# EAGLE schematic main (EAGLE 6.4)
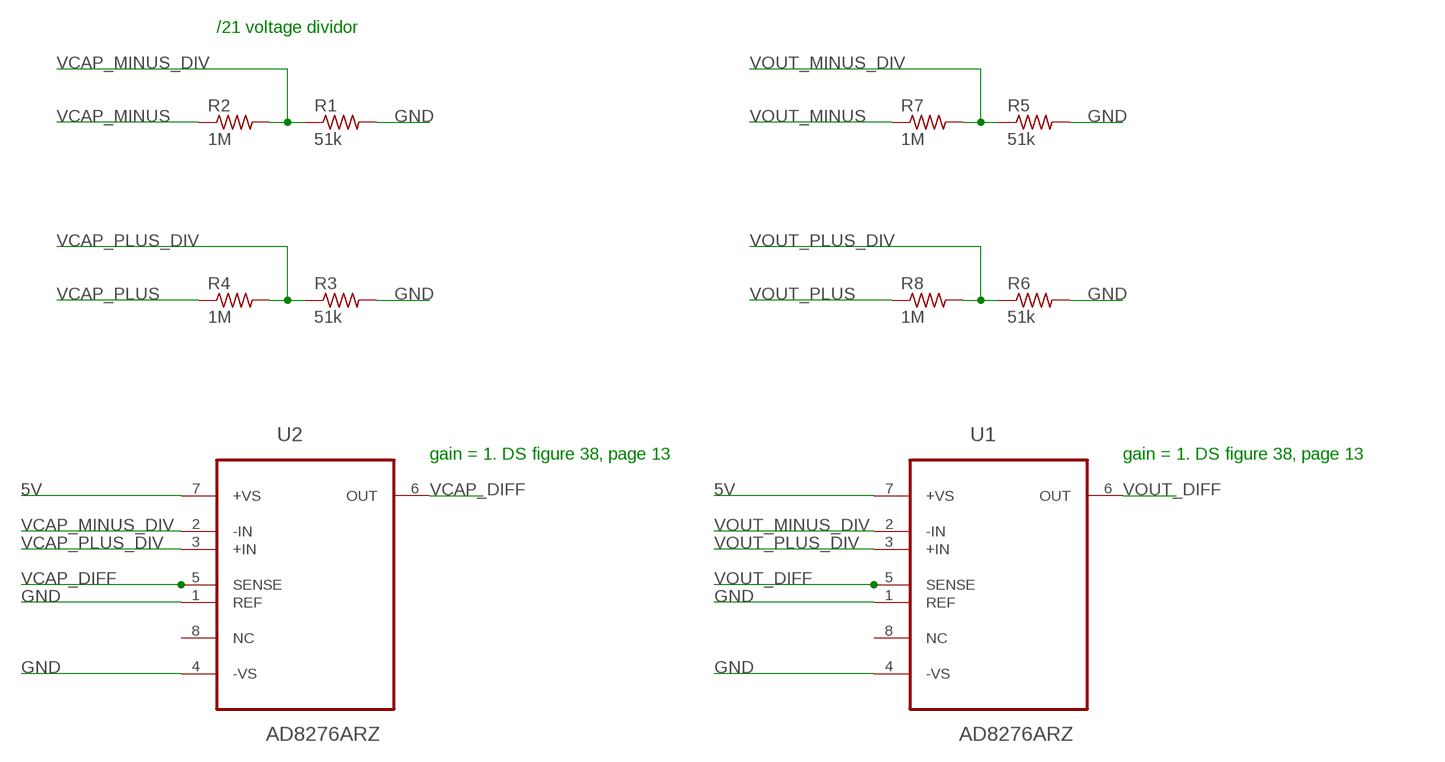
[diagram p0: schematic, sheet 1]

## Parts
R1  51k  R-US_R1206  [R1206]
R2  1M  R-US_R1206  [R1206]
R3  51k  R-US_R1206  [R1206]
R4  1M  R-US_R1206  [R1206]
R5  51k  R-US_R1206  [R1206]
R6  51k  R-US_R1206  [R1206]
R7  1M  R-US_R1206  [R1206]
R8  1M  R-US_R1206  [R1206]
U1  AD8276ARZ  [SOIC127P600X175-8N]
U2  AD8276ARZ  [SOIC127P600X175-8N]

## Nets
5V: U1.7(+VS) U2.7(+VS)
GND: R1.2 R3.2 R5.2 R6.2 U1.1(REF) U1.4(-VS) U2.1(REF) U2.4(-VS)
VCAP_DIFF: U2.5(SENSE) U2.6(OUT)
VCAP_MINUS_DIV: R1.1 R2.2 U2.2(-IN)
VCAP_PLUS_DIV: R3.1 R4.2 U2.3(+IN)
VOUT_DIFF: U1.5(SENSE) U1.6(OUT)
VOUT_MINUS: R7.1
VOUT_MINUS_DIV: R5.1 R7.2 U1.2(-IN)
VOUT_PLUS: R8.1
VOUT_PLUS_DIV: R6.1 R8.2 U1.3(+IN)
Unconnected: R2.1 R4.1 U1.8(NC) U2.8(NC)

## Notes on the sheet
- /21 voltage dividor
- gain = 1. DS figure 38, page 13 | gain = 1. DS figure 38, page 13

## Library data of the parts
R1-R8 = resistor:R-US_: RESISTOR, American symbol
U1 U2 = ADI-AD8276ARZ:AD8276ARZ: Unity-Gain Difference Amplifiers; MPN: AD8276ARZ; OC_FARNELL: 1827398; OC_NEWARK: 08R6717; PACKAGE: SOIC-8; SUPPLIER: Analog Devices